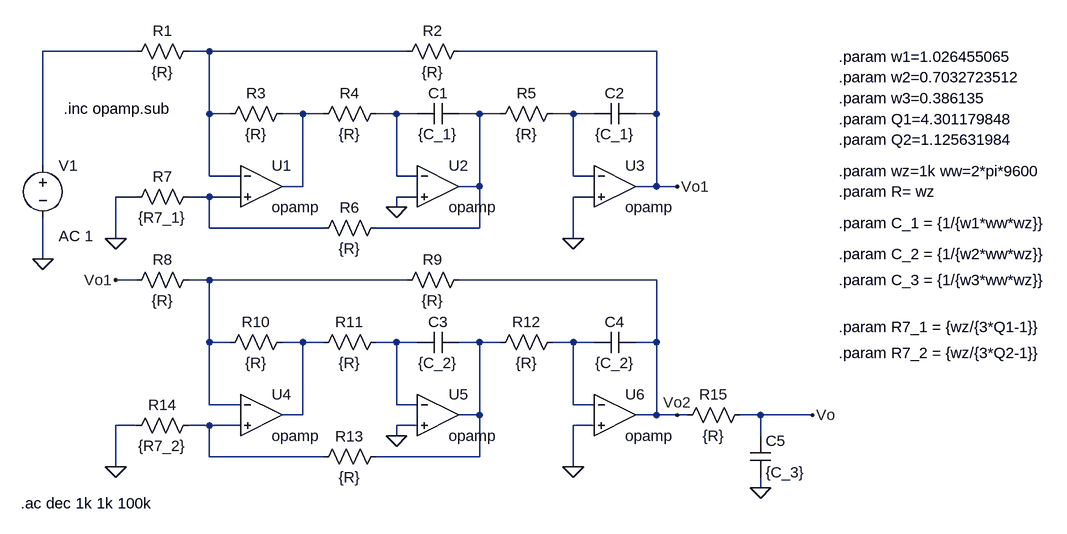
[diagram p0: schematic Circuito_3.asc]
Circuito_3.asc, the LTspice schematic file:
Version 4
SHEET 1 1640 952
WIRE 64 80 -80 80
WIRE 176 80 144 80
WIRE 480 80 176 80
WIRE 864 80 560 80
WIRE 176 176 176 80
WIRE 208 176 176 176
WIRE 320 176 288 176
WIRE 352 176 320 176
WIRE 464 176 432 176
WIRE 496 176 464 176
WIRE 592 176 560 176
WIRE 624 176 592 176
WIRE 736 176 704 176
WIRE 768 176 736 176
WIRE 864 176 864 80
WIRE 864 176 832 176
WIRE -80 256 -80 80
WIRE 176 272 176 176
WIRE 224 272 176 272
WIRE 464 272 464 176
WIRE 496 272 464 272
WIRE 736 272 736 176
WIRE 768 272 736 272
WIRE 320 288 320 176
WIRE 320 288 288 288
WIRE 592 288 592 176
WIRE 592 288 560 288
WIRE 864 288 864 176
WIRE 864 288 832 288
WIRE 896 288 864 288
WIRE 64 304 32 304
WIRE 176 304 144 304
WIRE 224 304 176 304
WIRE 496 304 464 304
WIRE 768 304 736 304
WIRE 464 320 464 304
WIRE 176 352 176 304
WIRE 352 352 176 352
WIRE 592 352 592 288
WIRE 592 352 432 352
WIRE 32 368 32 304
WIRE 736 368 736 304
WIRE -80 400 -80 336
WIRE 64 432 32 432
WIRE 176 432 144 432
WIRE 480 432 176 432
WIRE 864 432 560 432
WIRE 176 528 176 432
WIRE 208 528 176 528
WIRE 320 528 288 528
WIRE 352 528 320 528
WIRE 464 528 432 528
WIRE 496 528 464 528
WIRE 592 528 560 528
WIRE 624 528 592 528
WIRE 736 528 704 528
WIRE 768 528 736 528
WIRE 864 528 864 432
WIRE 864 528 832 528
WIRE 176 624 176 528
WIRE 224 624 176 624
WIRE 464 624 464 528
WIRE 496 624 464 624
WIRE 736 624 736 528
WIRE 768 624 736 624
WIRE 320 640 320 528
WIRE 320 640 288 640
WIRE 592 640 592 528
WIRE 592 640 560 640
WIRE 864 640 864 528
WIRE 864 640 832 640
WIRE 896 640 864 640
WIRE 912 640 896 640
WIRE 1024 640 992 640
WIRE 1104 640 1024 640
WIRE 64 656 32 656
WIRE 176 656 144 656
WIRE 224 656 176 656
WIRE 496 656 464 656
WIRE 768 656 736 656
WIRE 464 672 464 656
WIRE 1024 672 1024 640
WIRE 176 704 176 656
WIRE 352 704 176 704
WIRE 592 704 592 640
WIRE 592 704 432 704
WIRE 32 720 32 656
WIRE 736 720 736 656
WIRE 1024 752 1024 736
FLAG 32 368 0
FLAG -80 400 0
FLAG 736 368 0
FLAG 32 720 0
FLAG 736 720 0
FLAG 1024 752 0
FLAG 896 288 Vo1
FLAG 32 432 Vo1
FLAG 896 640 Vo2
FLAG 1104 640 Vo
FLAG 464 320 0
FLAG 464 672 0
SYMBOL res 160 64 R90
WINDOW 0 0 56 VBottom 2
WINDOW 3 32 56 VTop 2
SYMATTR InstName R1
SYMATTR Value {R}
SYMBOL res 576 64 R90
WINDOW 0 0 56 VBottom 2
WINDOW 3 32 56 VTop 2
SYMATTR InstName R2
SYMATTR Value {R}
SYMBOL res 304 160 R90
WINDOW 0 0 56 VBottom 2
WINDOW 3 32 56 VTop 2
SYMATTR InstName R3
SYMATTR Value {R}
SYMBOL res 448 160 R90
WINDOW 0 0 56 VBottom 2
WINDOW 3 32 56 VTop 2
SYMATTR InstName R4
SYMATTR Value {R}
SYMBOL res 720 160 R90
WINDOW 0 0 56 VBottom 2
WINDOW 3 32 56 VTop 2
SYMATTR InstName R5
SYMATTR Value {R}
SYMBOL res 448 336 R90
WINDOW 0 0 56 VBottom 2
WINDOW 3 32 56 VTop 2
SYMATTR InstName R6
SYMATTR Value {R}
SYMBOL OpAmps\\opamp 256 224 R0
SYMATTR InstName U1
SYMBOL OpAmps\\opamp 528 224 R0
SYMATTR InstName U2
SYMBOL OpAmps\\opamp 800 224 R0
SYMATTR InstName U3
SYMBOL cap 560 160 R90
WINDOW 0 0 32 VBottom 2
WINDOW 3 32 32 VTop 2
SYMATTR InstName C1
SYMATTR Value {C_1}
SYMBOL cap 832 160 R90
WINDOW 0 0 32 VBottom 2
WINDOW 3 32 32 VTop 2
SYMATTR InstName C2
SYMATTR Value {C_1}
SYMBOL voltage -80 240 R0
WINDOW 123 24 124 Left 2
WINDOW 39 0 0 Left 0
SYMATTR InstName V1
SYMATTR Value ""
SYMATTR Value2 AC 1
SYMBOL res 160 288 R90
WINDOW 0 0 56 VBottom 2
WINDOW 3 32 56 VTop 2
SYMATTR InstName R7
SYMATTR Value {R7_1}
SYMBOL res 160 416 R90
WINDOW 0 0 56 VBottom 2
WINDOW 3 32 56 VTop 2
SYMATTR InstName R8
SYMATTR Value {R}
SYMBOL res 576 416 R90
WINDOW 0 0 56 VBottom 2
WINDOW 3 32 56 VTop 2
SYMATTR InstName R9
SYMATTR Value {R}
SYMBOL res 304 512 R90
WINDOW 0 0 56 VBottom 2
WINDOW 3 32 56 VTop 2
SYMATTR InstName R10
SYMATTR Value {R}
SYMBOL res 448 512 R90
WINDOW 0 0 56 VBottom 2
WINDOW 3 32 56 VTop 2
SYMATTR InstName R11
SYMATTR Value {R}
SYMBOL res 720 512 R90
WINDOW 0 0 56 VBottom 2
WINDOW 3 32 56 VTop 2
SYMATTR InstName R12
SYMATTR Value {R}
SYMBOL res 448 688 R90
WINDOW 0 0 56 VBottom 2
WINDOW 3 32 56 VTop 2
SYMATTR InstName R13
SYMATTR Value {R}
SYMBOL OpAmps\\opamp 256 576 R0
SYMATTR InstName U4
SYMBOL OpAmps\\opamp 528 576 R0
SYMATTR InstName U5
SYMBOL OpAmps\\opamp 800 576 R0
SYMATTR InstName U6
SYMBOL cap 560 512 R90
WINDOW 0 0 32 VBottom 2
WINDOW 3 32 32 VTop 2
SYMATTR InstName C3
SYMATTR Value {C_2}
SYMBOL cap 832 512 R90
WINDOW 0 0 32 VBottom 2
WINDOW 3 32 32 VTop 2
SYMATTR InstName C4
SYMATTR Value {C_2}
SYMBOL res 160 640 R90
WINDOW 0 0 56 VBottom 2
WINDOW 3 32 56 VTop 2
SYMATTR InstName R14
SYMATTR Value {R7_2}
SYMBOL res 1008 624 R90
WINDOW 0 0 56 VBottom 2
WINDOW 3 32 56 VTop 2
SYMATTR InstName R15
SYMATTR Value {R}
SYMBOL cap 1008 672 R0
SYMATTR InstName C5
SYMATTR Value {C_3}
TEXT 1144 184 Left 2 !.param Q1=4.301179848
TEXT 1144 216 Left 2 !.param Q2=1.125631984
TEXT 1144 88 Left 2 !.param w1=1.026455065
TEXT 1144 120 Left 2 !.param w2=0.7032723512
TEXT 1144 152 Left 2 !.param w3=0.386135
TEXT 1144 296 Left 2 !.param R= wz
TEXT 1144 344 Left 2 !.param C_1 = {1/{w1*ww*wz}}
TEXT 1144 392 Left 2 !.param C_2 = {1/{w2*ww*wz}}
TEXT 1144 432 Left 2 !.param C_3 = {1/{w3*ww*wz}}
TEXT 1144 264 Left 2 !.param wz=1k ww=2*pi*9600
TEXT 1144 504 Left 2 !.param R7_1 = {wz/{3*Q1-1}}
TEXT 1144 544 Left 2 !.param R7_2 = {wz/{3*Q2-1}}
TEXT -114 776 Left 2 !.ac dec 1k 1k 100k
TEXT -48 168 Left 2 !.inc opamp.sub

The netlist it stands for:
* Circuito_3.asc
R1 N002 N001 {R}
R2 Vo1 N002 {R}
R3 N003 N002 {R}
R4 N004 N003 {R}
R5 N006 N005 {R}
R6 N005 N007 {R}
XU1 N002 N007 N003 opamp Aol=100K GBW=10Meg  ; pins invin noninvin out
XU2 N004 0 N005 opamp Aol=100K GBW=10Meg  ; pins invin noninvin out
XU3 N006 0 Vo1 opamp Aol=100K GBW=10Meg  ; pins invin noninvin out
C1 N005 N004 {C_1}
C2 Vo1 N006 {C_1}
V1 N001 0 AC 1
R7 N007 0 {R7_1}
R8 N008 Vo1 {R}
R9 Vo2 N008 {R}
R10 N009 N008 {R}
R11 N010 N009 {R}
R12 N012 N011 {R}
R13 N011 N013 {R}
XU4 N008 N013 N009 opamp Aol=100K GBW=10Meg  ; pins invin noninvin out
XU5 N010 0 N011 opamp Aol=100K GBW=10Meg  ; pins invin noninvin out
XU6 N012 0 Vo2 opamp Aol=100K GBW=10Meg  ; pins invin noninvin out
C3 N011 N010 {C_2}
C4 Vo2 N012 {C_2}
R14 N013 0 {R7_2}
R15 Vo Vo2 {R}
C5 Vo 0 {C_3}
.param Q1=4.301179848
.param Q2=1.125631984
.param w1=1.026455065
.param w2=0.7032723512
.param w3=0.386135
.param R= wz
.param C_1 = {1/{w1*ww*wz}}
.param C_2 = {1/{w2*ww*wz}}
.param C_3 = {1/{w3*ww*wz}}
.param wz=1k ww=2*pi*9600
.param R7_1 = {wz/{3*Q1-1}}
.param R7_2 = {wz/{3*Q2-1}}
.ac dec 1k 1k 100k
.inc opamp.sub
.backanno
.end